# EAGLE design MiniLA (EAGLE 4.16)
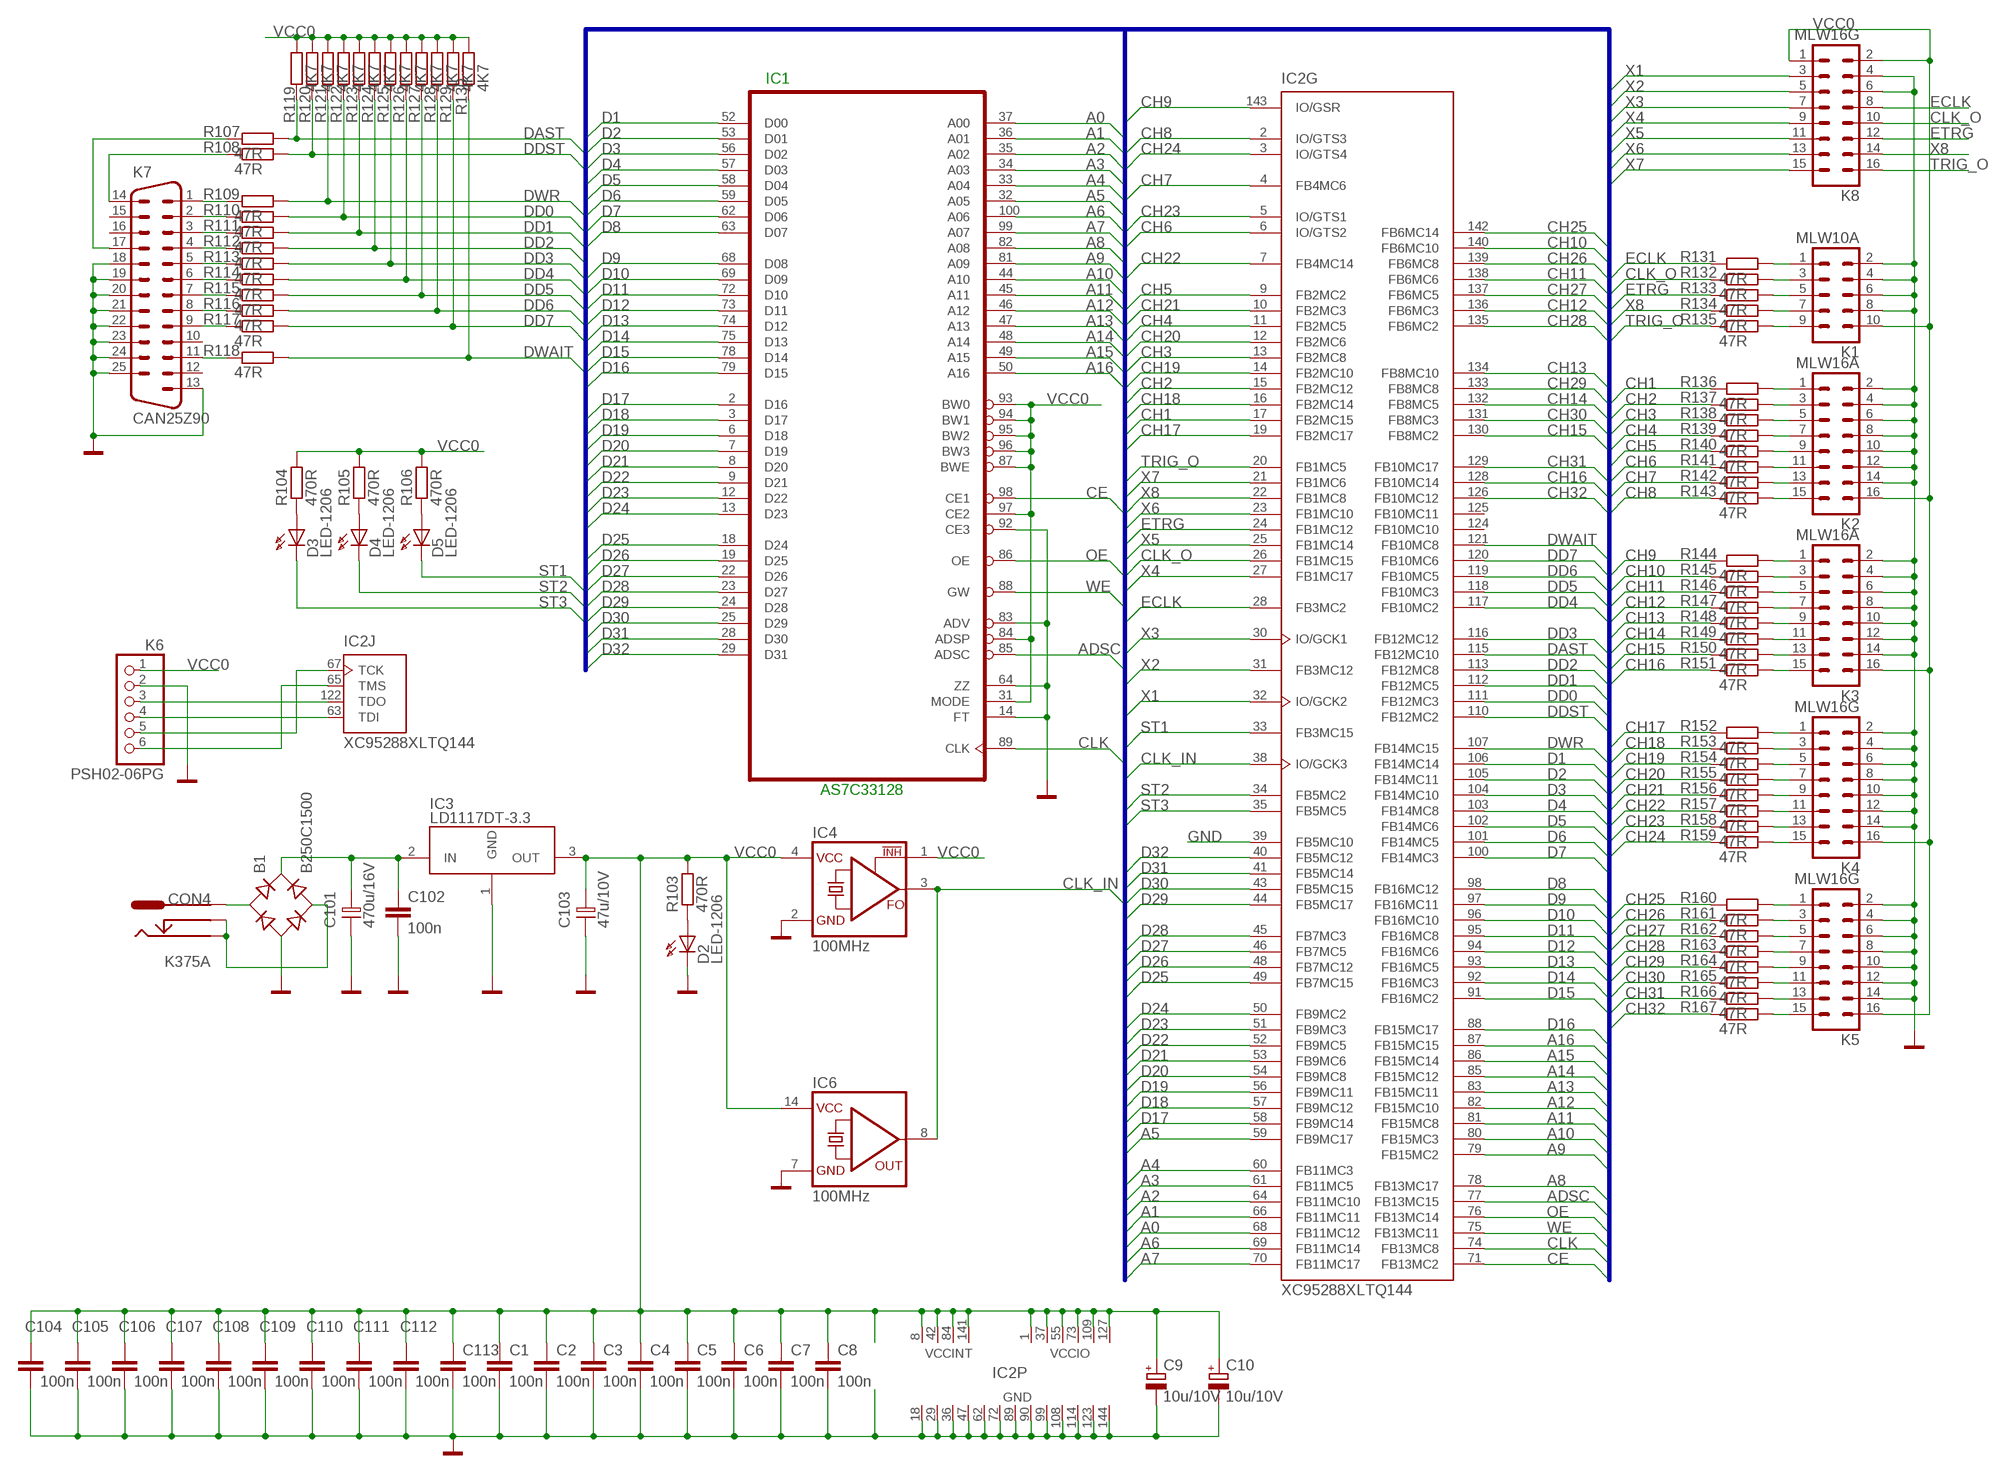
[diagram p0: schematic, sheet 1]

## Parts
B1  B250C1500  RB1A  [RB1A]
C1  100n  C-EUC1206  [C1206]
C2  100n  C-EUC1206  [C1206]
C3  100n  C-EUC1206  [C1206]
C4  100n  C-EUC1206  [C1206]
C5  100n  C-EUC1206  [C1206]
C6  100n  C-EUC1206  [C1206]
C7  100n  C-EUC1206  [C1206]
C8  100n  C-EUC1206  [C1206]
C9  10u/10V  CPOL-EUCT7343  [CT7343]
C10  10u/10V  CPOL-EUCT7343  [CT7343]
C101  470u/16V  ELC-5  [ES-5]
C102  100n  C-EUC1206  [C1206]
C103  47u/10V  ELC-2,5S  [ES-2,5S]
C104  100n  C-EUC1206  [C1206]
C105  100n  C-EUC1206  [C1206]
C106  100n  C-EUC1206  [C1206]
C107  100n  C-EUC1206  [C1206]
C108  100n  C-EUC1206  [C1206]
C109  100n  C-EUC1206  [C1206]
C110  100n  C-EUC1206  [C1206]
C111  100n  C-EUC1206  [C1206]
C112  100n  C-EUC1206  [C1206]
C113  100n  C-EUC1206  [C1206]
CON4  K375A  PWCON  [PWRC21]
D2  LED-1206  [SM-1206]
D3  LED-1206  [SM-1206]
D4  LED-1206  [SM-1206]
D5  LED-1206  [SM-1206]
IC1  AS7C33128  AS7C33128PQFP100  [QFP100]
IC2  XC95288XLTQ144  XC9500TQ144TQ144_45  [TQ144_45]
IC3  LD1117DT-3.3  LD1117DT  [TO-252]
IC4  100MHz  CO43TR  [CO43AND46]
IC6  100MHz  QG5860  [DIL14S]
K1  MLW10A  ML10L  [ML10L]
K2  MLW16A  ML16L  [ML16L]
K3  MLW16A  ML16L  [ML16L]
K4  MLW16G  ML16  [ML16]
K5  MLW16G  ML16  [ML16]
K6  PSH02-06PG  PINHD-1X6  [1X06]
K7  CAN25Z90  M25HP  [M25HP]
K8  MLW16G  ML16  [ML16]
R103  470R  R-EU_M0805  [M0805]
R104  470R  R-EU_M0805  [M0805]
R105  470R  R-EU_M0805  [M0805]
R106  470R  R-EU_M0805  [M0805]
R107  47R  R-EU_M0805  [M0805]
R108  47R  R-EU_M0805  [M0805]
R109  47R  R-EU_M0805  [M0805]
R110  47R  R-EU_M0805  [M0805]
R111  47R  R-EU_M0805  [M0805]
R112  47R  R-EU_M0805  [M0805]
R113  47R  R-EU_M0805  [M0805]
R114  47R  R-EU_M0805  [M0805]
R115  47R  R-EU_M0805  [M0805]
R116  47R  R-EU_M0805  [M0805]
R117  47R  R-EU_M0805  [M0805]
R118  47R  R-EU_M0805  [M0805]
R119  4K7  R-EU_M0805  [M0805]
R120  4K7  R-EU_M0805  [M0805]
R121  4K7  R-EU_M0805  [M0805]
R122  4K7  R-EU_M0805  [M0805]
R123  4K7  R-EU_M0805  [M0805]
R124  4K7  R-EU_M0805  [M0805]
R125  4K7  R-EU_M0805  [M0805]
R126  4K7  R-EU_M0805  [M0805]
R127  4K7  R-EU_M0805  [M0805]
R128  4K7  R-EU_M0805  [M0805]
R129  4K7  R-EU_M0805  [M0805]
R130  4K7  R-EU_M0805  [M0805]
R131  47R  R-EU_M0805  [M0805]
R132  47R  R-EU_M0805  [M0805]
R133  47R  R-EU_M0805  [M0805]
R134  47R  R-EU_M0805  [M0805]
R135  47R  R-EU_M0805  [M0805]
R136  47R  R-EU_M0805  [M0805]
R137  47R  R-EU_M0805  [M0805]
R138  47R  R-EU_M0805  [M0805]
R139  47R  R-EU_M0805  [M0805]
R140  47R  R-EU_M0805  [M0805]
R141  47R  R-EU_M0805  [M0805]
R142  47R  R-EU_M0805  [M0805]
R143  47R  R-EU_M0805  [M0805]
R144  47R  R-EU_M0805  [M0805]
R145  47R  R-EU_M0805  [M0805]
R146  47R  R-EU_M0805  [M0805]
R147  47R  R-EU_M0805  [M0805]
R148  47R  R-EU_M0805  [M0805]
R149  47R  R-EU_M0805  [M0805]
R150  47R  R-EU_M0805  [M0805]
R151  47R  R-EU_M0805  [M0805]
R152  47R  R-EU_M0805  [M0805]
R153  47R  R-EU_M0805  [M0805]
R154  47R  R-EU_M0805  [M0805]
R155  47R  R-EU_M0805  [M0805]
R156  47R  R-EU_M0805  [M0805]
R157  47R  R-EU_M0805  [M0805]
R158  47R  R-EU_M0805  [M0805]
R159  47R  R-EU_M0805  [M0805]
R160  47R  R-EU_M0805  [M0805]
R161  47R  R-EU_M0805  [M0805]
R162  47R  R-EU_M0805  [M0805]
R163  47R  R-EU_M0805  [M0805]
R164  47R  R-EU_M0805  [M0805]
R165  47R  R-EU_M0805  [M0805]
R166  47R  R-EU_M0805  [M0805]
R167  47R  R-EU_M0805  [M0805]

## Nets
A0: IC1.37(A00) IC2.68(G:FB11MC12)
A1: IC1.36(A01) IC2.66(G:FB11MC11)
A2: IC1.35(A02) IC2.64(G:FB11MC10)
A3: IC1.34(A03) IC2.61(G:FB11MC5)
A4: IC1.33(A04) IC2.60(G:FB11MC3)
A5: IC1.32(A05) IC2.59(G:FB9MC17)
A6: IC1.100(A06) IC2.69(G:FB11MC14)
A7: IC1.99(A07) IC2.70(G:FB11MC17)
A8: IC1.82(A08) IC2.78(G:FB13MC17)
A9: IC1.81(A09) IC2.79(G:FB15MC2)
A10: IC1.44(A10) IC2.80(G:FB15MC3)
A11: IC1.45(A11) IC2.81(G:FB15MC8)
A12: IC1.46(A12) IC2.82(G:FB15MC10)
A13: IC1.47(A13) IC2.83(G:FB15MC11)
A14: IC1.48(A14) IC2.85(G:FB15MC12)
A15: IC1.49(A15) IC2.86(G:FB15MC14)
A16: IC1.50(A16) IC2.87(G:FB15MC15)
ADSC: IC1.85(ADSC) IC2.77(G:FB13MC15)
CE: IC1.98(CE1) IC2.71(G:FB13MC2)
CH1: IC2.17(G:FB2MC15) R136.1
CH2: IC2.15(G:FB2MC12) R137.1
CH3: IC2.13(G:FB2MC8) R138.1
CH4: IC2.11(G:FB2MC5) R139.1
CH5: IC2.9(G:FB2MC2) R140.1
CH6: IC2.6(G:IO/GTS2) R141.1
CH7: IC2.4(G:FB4MC6) R142.1
CH8: IC2.2(G:IO/GTS3) R143.1
CH9: IC2.143(G:IO/GSR) R144.1
CH10: IC2.140(G:FB6MC10) R145.1
CH11: IC2.138(G:FB6MC6) R146.1
CH12: IC2.136(G:FB6MC3) R147.1
CH13: IC2.134(G:FB8MC10) R148.1
CH14: IC2.132(G:FB8MC5) R149.1
CH15: IC2.130(G:FB8MC2) R150.1
CH16: IC2.128(G:FB10MC14) R151.1
CH17: IC2.19(G:FB2MC17) R152.1
CH18: IC2.16(G:FB2MC14) R153.1
CH19: IC2.14(G:FB2MC10) R154.1
CH20: IC2.12(G:FB2MC6) R155.1
CH21: IC2.10(G:FB2MC3) R156.1
CH22: IC2.7(G:FB4MC14) R157.1
CH23: IC2.5(G:IO/GTS1) R158.1
CH24: IC2.3(G:IO/GTS4) R159.1
CH25: IC2.142(G:FB6MC14) R160.1
CH26: IC2.139(G:FB6MC8) R161.1
CH27: IC2.137(G:FB6MC5) R162.1
CH28: IC2.135(G:FB6MC2) R163.1
CH29: IC2.133(G:FB8MC8) R164.1
CH30: IC2.131(G:FB8MC3) R165.1
CH31: IC2.129(G:FB10MC17) R166.1
CH32: IC2.126(G:FB10MC12) R167.1
CLK: IC1.89(CLK) IC2.74(G:FB13MC8)
CLK_IN: IC2.38(G:IO/GCK3) IC4.3(OUTPUT) IC6.8(OUT)
CLK_O: IC2.26(G:FB1MC15) K8.10 R132.1
D1: IC1.52(D00) IC2.106(G:FB14MC14)
D2: IC1.53(D01) IC2.105(G:FB14MC11)
D3: IC1.56(D02) IC2.104(G:FB14MC10)
D4: IC1.57(D03) IC2.103(G:FB14MC8)
D5: IC1.58(D04) IC2.102(G:FB14MC6)
D6: IC1.59(D05) IC2.101(G:FB14MC5)
D7: IC1.62(D06) IC2.100(G:FB14MC3)
D8: IC1.63(D07) IC2.98(G:FB16MC12)
D9: IC1.68(D08) IC2.97(G:FB16MC11)
D10: IC1.69(D09) IC2.96(G:FB16MC10)
D11: IC1.72(D10) IC2.95(G:FB16MC8)
D12: IC1.73(D11) IC2.94(G:FB16MC6)
D13: IC1.74(D12) IC2.93(G:FB16MC5)
D14: IC1.75(D13) IC2.92(G:FB16MC3)
D15: IC1.78(D14) IC2.91(G:FB16MC2)
D16: IC1.79(D15) IC2.88(G:FB15MC17)
D17: IC1.2(D16) IC2.58(G:FB9MC14)
D18: IC1.3(D17) IC2.57(G:FB9MC12)
D19: IC1.6(D18) IC2.56(G:FB9MC11)
D20: IC1.7(D19) IC2.54(G:FB9MC8)
D21: IC1.8(D20) IC2.53(G:FB9MC6)
D22: IC1.9(D21) IC2.52(G:FB9MC5)
D23: IC1.12(D22) IC2.51(G:FB9MC3)
D24: IC1.13(D23) IC2.50(G:FB9MC2)
D25: IC1.18(D24) IC2.49(G:FB7MC15)
D26: IC1.19(D25) IC2.48(G:FB7MC12)
D27: IC1.22(D26) IC2.46(G:FB7MC5)
D28: IC1.23(D27) IC2.45(G:FB7MC3)
D29: IC1.24(D28) IC2.44(G:FB5MC17)
D30: IC1.25(D29) IC2.43(G:FB5MC15)
D31: IC1.28(D30) IC2.41(G:FB5MC14)
D32: IC1.29(D31) IC2.40(G:FB5MC12)
DAST: IC2.115(G:FB12MC10) R107.2 R119.1
DD0: IC2.111(G:FB12MC3) R110.2 R122.1
DD1: IC2.112(G:FB12MC5) R111.2 R123.1
DD2: IC2.113(G:FB12MC8) R112.2 R124.1
DD3: IC2.116(G:FB12MC12) R113.2 R125.1
DD4: IC2.117(G:FB10MC2) R114.2 R126.1
DD5: IC2.118(G:FB10MC3) R115.2 R127.1
DD6: IC2.119(G:FB10MC5) R116.2 R128.1
DD7: IC2.120(G:FB10MC6) R117.2 R129.1
DDST: IC2.110(G:FB12MC2) R108.2 R120.1
DWAIT: IC2.121(G:FB10MC8) R118.2 R130.1
DWR: IC2.107(G:FB14MC15) R109.2 R121.1
ECLK: IC2.28(G:FB3MC2) K8.8 R131.1
ETRG: IC2.24(G:FB1MC12) K8.12 R133.1
GND: B1.- C1.1 C2.1 C3.1 C4.1 C5.1 C6.1 C7.1 C8.1 C9.- C10.- C101.M C102.1 C103.M C104.1 C105.1 C106.1 C107.1 C108.1 C109.1 C110.1 C111.1 C112.1 C113.1 D2.2(C) IC1.14(FT) IC1.64(ZZ) IC1.83(ADV) IC1.92(CE3) IC2.18(P:GND) IC2.29(P:GND) IC2.36(P:GND) IC2.39(G:FB5MC10) IC2.47(P:GND) IC2.62(P:GND) IC2.72(P:GND) IC2.89(P:GND) IC2.90(P:GND) IC2.99(P:GND) IC2.108(P:GND) IC2.114(P:GND) IC2.123(P:GND) IC2.144(P:GND) IC3.1(GND) IC4.2(GND) IC6.7(GND) K1.2 K1.4 K1.6 K1.8 K2.2 K2.4 K2.6 K2.8 K2.10 K2.12 K2.14 K3.2 K3.4 K3.6 K3.8 K3.10 K3.12 K3.14 K4.2 K4.4 K4.6 K4.8 K4.10 K4.12 K4.14 K5.2 K5.4 K5.6 K5.8 K5.10 K5.12 K5.14 K6.2 K7.13 K7.18 K7.19 K7.20 K7.21 K7.22 K7.23 K7.24 K7.25 K8.4 K8.6
N$1: D2.1(A) R103.1
N$2: K7.9 R117.1
N$3: K7.8 R116.1
N$4: K7.7 R115.1
N$5: K7.6 R114.1
N$6: K7.5 R113.1
N$7: K7.4 R112.1
N$8: B1.AC1 CON4.1
N$9: K7.3 R111.1
N$10: K7.2 R110.1
N$11: B1.AC2 CON4.2 CON4.3
N$12: K7.1 R109.1
N$13: K1.1 R131.2
N$14: K1.3 R132.2
N$15: K1.5 R133.2
N$16: K1.7 R134.2
N$17: D3.1(A) R104.1
N$18: K1.9 R135.2
N$21: D4.1(A) R105.1
N$22: K7.11 R118.1
N$23: K7.14 R108.1
N$24: K2.1 R136.2
N$25: K2.3 R137.2
N$26: K2.5 R138.2
N$27: K2.7 R139.2
N$28: K2.9 R140.2
N$29: K2.11 R141.2
N$30: K2.13 R142.2
N$31: K2.15 R143.2
N$32: K3.1 R144.2
N$33: K3.3 R145.2
N$34: K3.5 R146.2
N$35: K3.7 R147.2
N$36: K3.9 R148.2
N$37: K3.11 R149.2
N$38: K3.13 R150.2
N$39: K3.15 R151.2
N$40: B1.+ C101.P C102.2 IC3.2(IN)
N$41: K4.1 R152.2
N$42: K4.3 R153.2
N$43: K4.5 R154.2
N$44: K4.7 R155.2
N$45: D5.1(A) R106.1
N$46: K4.9 R156.2
N$47: K4.11 R157.2
N$48: K4.13 R158.2
N$49: K4.15 R159.2
N$50: K5.1 R160.2
N$53: K5.3 R161.2
N$54: K5.5 R162.2
N$55: K5.7 R163.2
N$56: K5.9 R164.2
N$57: K5.11 R165.2
N$58: K5.13 R166.2
N$59: K5.15 R167.2
N$60: K7.17 R107.1
OE: IC1.86(OE) IC2.76(G:FB13MC14)
ST1: D5.2(C) IC2.33(G:FB3MC15)
ST2: D4.2(C) IC2.34(G:FB5MC2)
ST3: D3.2(C) IC2.35(G:FB5MC5)
TCK: IC2.67(J:TCK) K6.5
TDI: IC2.63(J:TDI) K6.4
TDO: IC2.122(J:TDO) K6.3
TMS: IC2.65(J:TMS) K6.6
TRIG_O: IC2.20(G:FB1MC5) K8.16 R135.1
VCC0: C1.2 C2.2 C3.2 C4.2 C5.2 C6.2 C7.2 C8.2 C9.+ C10.+ C103.P C104.2 C105.2 C106.2 C107.2 C108.2 C109.2 C110.2 C111.2 C112.2 C113.2 IC1.31(MODE) IC1.84(ADSP) IC1.87(BWE) IC1.93(BW0) IC1.94(BW1) IC1.95(BW2) IC1.96(BW3) IC1.97(CE2) IC2.1(P:VCCIO) IC2.8(P:VCCINT) IC2.37(P:VCCIO) IC2.42(P:VCCINT) IC2.55(P:VCCIO) IC2.73(P:VCCIO) IC2.84(P:VCCINT) IC2.109(P:VCCIO) IC2.127(P:VCCIO) IC2.141(P:VCCINT) IC3.3(OUT) IC4.1(INH) IC4.4(VCC) IC6.14(VCC) K1.10 K2.16 K3.16 K4.16 K5.16 K6.1 K8.1 K8.2 R103.2 R104.2 R105.2 R106.2 R119.2 R120.2 R121.2 R122.2 R123.2 R124.2 R125.2 R126.2 R127.2 R128.2 R129.2 R130.2
WE: IC1.88(GW) IC2.75(G:FB13MC11)
X1: IC2.32(G:IO/GCK2) K8.3
X2: IC2.31(G:FB3MC12) K8.5
X3: IC2.30(G:IO/GCK1) K8.7
X4: IC2.27(G:FB1MC17) K8.9
X5: IC2.25(G:FB1MC14) K8.11
X6: IC2.23(G:FB1MC10) K8.13
X7: IC2.21(G:FB1MC6) K8.15
X8: IC2.22(G:FB1MC8) K8.14 R134.1
Unconnected: IC2.124(G:FB10MC10) IC2.125(G:FB10MC11) K7.10 K7.12 K7.15 K7.16 K7.G1 K7.G2

## Buses
CH[1..36],D[1..31],A[0..16],X[1..7],CE,OE,WE,CLK,ADSC,ECLK,ETRG1,ETRG2,EX1,EX2,ICLK,ST1,ST2,ST3,DD[0..7],DWR,DDST,DAST,DWAIT

## Notes on the sheet
- IC1
- AS7C33128

## Power pins joined to a net without a drawn wire
GND: IC1.5(GND) IC1.10(GND) IC1.17(GND) IC1.21(GND) IC1.26(GND) IC1.39(GND) IC1.55(GND) IC1.60(GND) IC1.67(GND) IC1.71(GND) IC1.76(GND) IC1.90(GND)
VCC0: IC1.4(VCC0) IC1.11(VCC0) IC1.15(VCC0) IC1.20(VCC0) IC1.27(VCC0) IC1.41(VCC0) IC1.54(VCC0) IC1.61(VCC0) IC1.65(VCC0) IC1.70(VCC0) IC1.77(VCC0) IC1.91(VCC0)

## Library data of the parts
B1 = rectifier:RB1A: RECTIFIER 1 A
C1-C8 C102 C104-C113 = rcl:C-EU: CAPACITOR, European symbol
C9 C10 = rcl:CPOL-EU: POLARIZED CAPACITOR, European symbol
C101 = _yhf_spec:ELC-5
C103 = _yhf_spec:ELC-2,5S
CON4 = NETWORK:PWCON
D2-D5 = minila:LED-1206
IC1 = minila:AS7C33128
IC2 = minila:XC9500TQ144: Xilinx CPLD XC9500 TQFP144
IC3 = _pwrsupp:LD1117DT
IC4 = oscillator:CO43*
IC6 = crystal:QG5860: CRYSTAL RESONATOR
K1 = con-harting-ml:ML10L: HARTING
K2 K3 = con-harting-ml:ML16L: HARTING
K4 K5 K8 = con-harting-ml:ML16: HARTING
K6 = pinhead:PINHD-1X6: PIN HEADER
K7 = SUBD-A:M25HP
R103-R167 = rcl:R-EU_: RESISTOR, European symbol

## Board
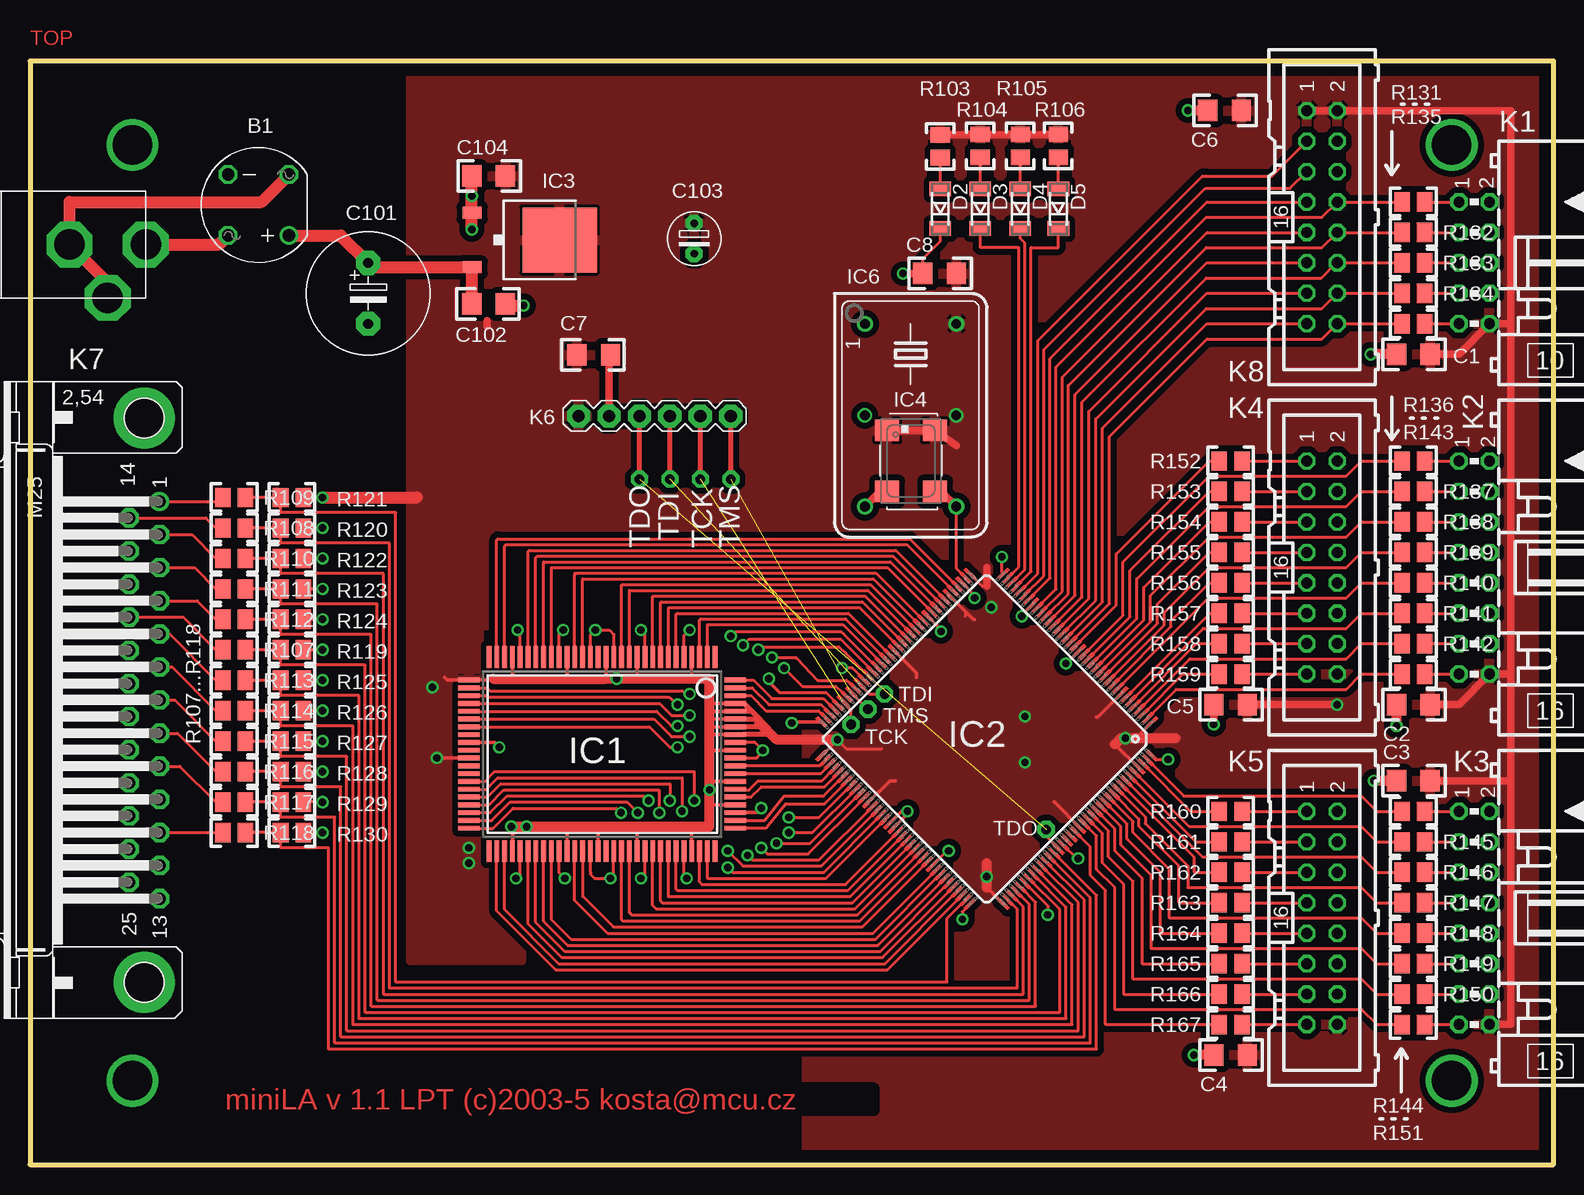
[diagram p1: board, top side]
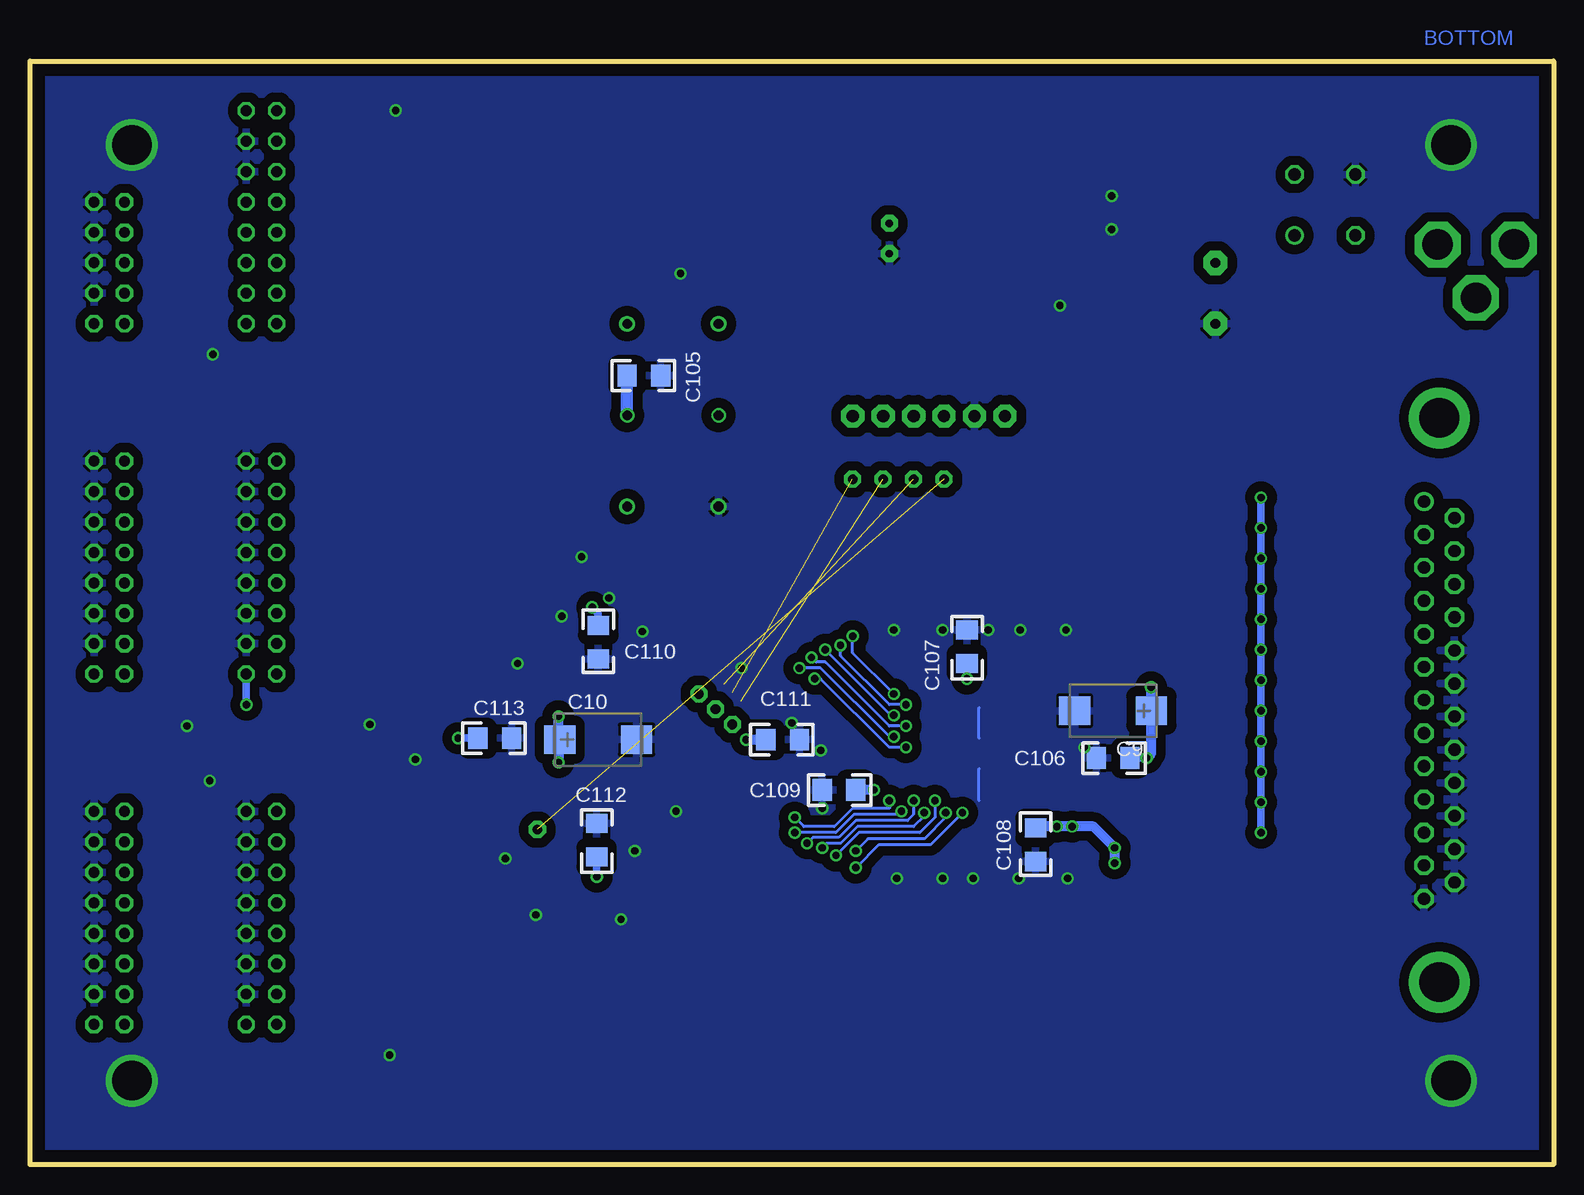
[diagram p2: board, bottom side, seen from below]

Size 127 x 92 mm. Coordinates in mm from the lower left corner, seen from the top.
Outline: 0,0 127,0 127,92 0,92 0,0
Copper layers (1*16): Top 0.035mm / dielectric 1.5mm / Bottom 0.035mm
Design rules "default": minimum track width 10mil, minimum drill 24mil, track to track 8mil, track to pad 8mil, pad to pad 8mil, via to via 8mil, smd to smd 8mil, copper to edge 40mil, drill to drill 8mil, minimum pad ring 10mil, minimum via ring 8mil, stop-mask expansion 0mil, vias tented up to drill 0mil, thermal gap 10mil

### Footprints (pad centres in the part's own frame; a part is rotated, then mirrored left to right if it is on the bottom)
RB1A = drill 1.016 round: + -2.54,2.54 | drill 1.016 octagon: - 2.54,-2.54; AC1 2.54,2.54; AC2 -2.54,-2.54
C1206 = smd 1.6 x 1.8: 1 -1.4,0; 2 1.4,0
CT7343 = smd 2.6 x 2.4: + -3.2,0; - 3.2,0
ES-5 = drill 0.813 pad 2.007 octagon: M 2.54,0; P -2.54,0
ES-2,5S = drill 0.61 pad 1.422 octagon: M 1.27,0; P -1.27,0
PWRC21 = drill 2.54 pad 3.81 octagon: 1 0,4.445; 2 6.35,4.445; 3 3.175,8.89
SM-1206 = smd 1.2 x 1.8: 1 -1.65,0; 2 1.65,0
QFP100 = smd 0.4 x 1.8: 1 -10.695,-6.83; 2 -10.045,-6.83; 3 -9.395,-6.83; 4 -8.745,-6.83; 5 -8.095,-6.83; 6 -7.445,-6.83; 7 -6.795,-6.83; 8 -6.145,-6.83; 9 -5.495,-6.83; 10 -4.845,-6.83; 11 -4.195,-6.83; 12 -3.545,-6.83; 13 -2.895,-6.83; 14 -2.245,-6.83; 15 -1.595,-6.83; 16 -0.945,-6.83; 17 -0.295,-6.83; 18 0.355,-6.83; 19 1.005,-6.83; 20 1.655,-6.83; 21 2.305,-6.83; 22 2.955,-6.83; 23 3.605,-6.83; 24 4.255,-6.83; 25 4.905,-6.83; 26 5.555,-6.83; 27 6.205,-6.83; 28 6.855,-6.83; 29 7.505,-6.83; 30 8.155,-6.83; 51 8.155,9.37; 52 7.505,9.37; 53 6.855,9.37; 54 6.205,9.37; 55 5.555,9.37; 56 4.905,9.37; 57 4.255,9.37; 58 3.605,9.37; 59 2.955,9.37; 60 2.305,9.37; 61 1.655,9.37; 62 1.005,9.37; 63 0.355,9.37; 64 -0.295,9.37; 65 -0.945,9.37; 66 -1.595,9.37; 67 -2.245,9.37; 68 -2.895,9.37; 69 -3.545,9.37; 70 -4.195,9.37; 71 -4.845,9.37; 72 -5.495,9.37; 73 -6.145,9.37; 74 -6.795,9.37; 75 -7.445,9.37; 76 -8.095,9.37; 77 -8.745,9.37; 78 -9.395,9.37; 79 -10.045,9.37; 80 -10.695,9.37 | smd 1.8 x 0.4: 31 9.83,-4.905; 32 9.83,-4.255; 33 9.83,-3.605; 34 9.83,-2.955; 35 9.83,-2.305; 36 9.83,-1.655; 37 9.83,-1.005; 38 9.83,-0.355; 39 9.83,0.295; 40 9.83,0.945; 41 9.83,1.595; 42 9.83,2.245; 43 9.83,2.895; 44 9.83,3.545; 45 9.83,4.195; 46 9.83,4.845; 47 9.83,5.495; 48 9.83,6.145; 49 9.83,6.795; 50 9.83,7.445; 81 -12.37,7.445; 82 -12.37,6.795; 83 -12.37,6.145; 84 -12.37,5.495; 85 -12.37,4.845; 86 -12.37,4.195; 87 -12.37,3.545; 88 -12.37,2.895; 89 -12.37,2.245; 90 -12.37,1.595; 91 -12.37,0.945; 92 -12.37,0.295; 93 -12.37,-0.355; 94 -12.37,-1.005; 95 -12.37,-1.655; 96 -12.37,-2.305; 97 -12.37,-2.955; 98 -12.37,-3.605; 99 -12.37,-4.255; 100 -12.37,-4.905
TQ144_45 = smd 0.203 x 0.203: 1 13.789,2.684; 2 13.435,3.038; 3 13.082,3.391; 4 12.728,3.745; 5 12.374,4.098; 6 12.021,4.452; 7 11.667,4.805; 8 11.314,5.159; 9 10.96,5.513; 10 10.607,5.866; 11 10.253,6.22; 12 9.899,6.574; 13 9.546,6.927; 14 9.192,7.28; 15 8.839,7.634; 16 8.485,7.987; 17 8.132,8.341; 18 7.778,8.695; 19 7.425,9.048; 20 7.071,9.402; 21 6.718,9.755; 22 6.364,10.109; 23 6.01,10.462; 24 5.657,10.816; 25 5.303,11.169; 26 4.95,11.523; 27 4.596,11.877; 28 4.243,12.23; 29 3.889,12.584; 30 3.535,12.937; 31 3.182,13.291; 32 2.828,13.644; 33 2.475,13.998; 34 2.121,14.351; 35 1.768,14.705; 36 1.414,15.059; 37 -1.414,15.059; 38 -1.768,14.705; 39 -2.121,14.351; 40 -2.475,13.998; 41 -2.828,13.644; 42 -3.182,13.291; 43 -3.535,12.937; 44 -3.889,12.584; 45 -4.243,12.23; 46 -4.596,11.877; 47 -4.95,11.523; 48 -5.303,11.169; 49 -5.657,10.816; 50 -6.01,10.462; 51 -6.364,10.109; 52 -6.718,9.755; 53 -7.071,9.402; 54 -7.425,9.048; 55 -7.778,8.695; 56 -8.132,8.341; 57 -8.485,7.987; 58 -8.839,7.634; 59 -9.192,7.28; 60 -9.546,6.927; 61 -9.899,6.574; 62 -10.253,6.22; 63 -10.607,5.866; 64 -10.96,5.513; 65 -11.314,5.159; 66 -11.667,4.805; 67 -12.021,4.452; 68 -12.374,4.098; 69 -12.728,3.745; 70 -13.082,3.391; 71 -13.435,3.038; 72 -13.789,2.684; 73 -13.789,-0.144; 74 -13.435,-0.498; 75 -13.082,-0.851; 76 -12.728,-1.205; 77 -12.374,-1.558; 78 -12.021,-1.912; 79 -11.667,-2.265; 80 -11.314,-2.619; 81 -10.96,-2.973; 82 -10.607,-3.326; 83 -10.253,-3.68; 84 -9.899,-4.034; 85 -9.546,-4.387; 86 -9.192,-4.74; 87 -8.839,-5.094; 88 -8.485,-5.447; 89 -8.132,-5.801; 90 -7.778,-6.155; 91 -7.425,-6.508; 92 -7.071,-6.862; 93 -6.718,-7.215; 94 -6.364,-7.569; 95 -6.01,-7.922; 96 -5.657,-8.276; 97 -5.303,-8.629; 98 -4.95,-8.983; 99 -4.596,-9.336; 100 -4.243,-9.69; 101 -3.889,-10.044; 102 -3.535,-10.397; 103 -3.182,-10.751; 104 -2.828,-11.104; 105 -2.475,-11.458; 106 -2.121,-11.812; 107 -1.768,-12.165; 108 -1.414,-12.519; 109 1.414,-12.519; 110 1.768,-12.165; 111 2.121,-11.812; 112 2.475,-11.458; 113 2.828,-11.104; 114 3.182,-10.751; 115 3.535,-10.397; 116 3.889,-10.044; 117 4.243,-9.69; 118 4.596,-9.336; 119 4.95,-8.983; 120 5.303,-8.629; 121 5.657,-8.276; 122 6.01,-7.922; 123 6.364,-7.569; 124 6.718,-7.215; 125 7.071,-6.862; 126 7.425,-6.508; 127 7.778,-6.155; 128 8.132,-5.801; 129 8.485,-5.447; 130 8.839,-5.094; 131 9.192,-4.74; 132 9.546,-4.387; 133 9.899,-4.034; 134 10.253,-3.68; 135 10.607,-3.326; 136 10.96,-2.973; 137 11.314,-2.619; 138 11.667,-2.265; 139 12.021,-1.912; 140 12.374,-1.558; 141 12.728,-1.205; 142 13.082,-0.851; 143 13.435,-0.498; 144 13.789,-0.144
TO-252 = smd 1 x 1.6: 1 -2.28,-6.07; 2 2.28,-6.07 | smd 5.4 x 6.2: 3 0,1.23
CO43AND46 = smd 1.8 x 2: 1 0,0; 2 5.08,0; 3 5.08,4; 4 0,4
DIL14S = drill 0.813 round: 1 -7.62,-3.81; 7 7.62,-3.81; 8 7.62,3.81; 14 -7.62,3.81
ML10L = drill 0.914 octagon: 1 -5.08,-1.27; 2 -5.08,1.27; 3 -2.54,-1.27; 4 -2.54,1.27; 5 0,-1.27; 6 0,1.27; 7 2.54,-1.27; 8 2.54,1.27; 9 5.08,-1.27; 10 5.08,1.27
ML16L = drill 0.914 octagon: 1 -8.89,-1.27; 2 -8.89,1.27; 3 -6.35,-1.27; 4 -6.35,1.27; 5 -3.81,-1.27; 6 -3.81,1.27; 7 -1.27,-1.27; 8 -1.27,1.27; 9 1.27,-1.27; 10 1.27,1.27; 11 3.81,-1.27; 12 3.81,1.27; 13 6.35,-1.27; 14 6.35,1.27; 15 8.89,-1.27; 16 8.89,1.27
ML16 = drill 0.914 octagon: 1 -8.89,-1.27; 2 -8.89,1.27; 3 -6.35,-1.27; 4 -6.35,1.27; 5 -3.81,-1.27; 6 -3.81,1.27; 7 -1.27,-1.27; 8 -1.27,1.27; 9 1.27,-1.27; 10 1.27,1.27; 11 3.81,-1.27; 12 3.81,1.27; 13 6.35,-1.27; 14 6.35,1.27; 15 8.89,-1.27; 16 8.89,1.27
1X06 = drill 1.016 pad 1.93 octagon: 1 -6.35,0; 2 -3.81,0; 3 -1.27,0; 4 1.27,0; 5 3.81,0; 6 6.35,0
M25HP = drill 1.016 pad 1.6 round: 1 -16.561,1.27 | drill 1.016 pad 1.6 octagon: 2 -13.792,1.27; 3 -11.049,1.27; 4 -8.28,1.27; 5 -5.512,1.27; 6 -2.769,1.27; 7 0,1.27; 8 2.769,1.27; 9 5.512,1.27; 10 8.28,1.27; 11 11.049,1.27; 12 13.792,1.27; 13 16.561,1.27; 14 -15.189,-1.27; 15 -12.421,-1.27; 16 -9.652,-1.27; 17 -6.909,-1.27; 18 -4.14,-1.27; 19 -1.372,-1.27; 20 1.372,-1.27; 21 4.14,-1.27; 22 6.909,-1.27; 23 9.652,-1.27; 24 12.421,-1.27; 25 15.189,-1.27 | drill 3.302 pad 5.08 round: G1 -23.52,0; G2 23.52,0
M0805 = smd 1.3 x 1.6: 1 -0.95,0; 2 0.95,0

### Placement (x,y rotation side)
B1  19.05,80.01 180 top
C1  115.32,67.56 0 top
C2  115.32,38.35 0 top
C3  115.32,32 0 top
C4  100.08,9.14 0 top
C5  100.08,38.35 0 top
C6  99.57,87.88 0 top
C7  46.99,67.5 180 top
C8  75.82,74.3 0 top
C9  36.72,37.85 180 bottom
C10  79.64,35.44 0 bottom
C101  28.19,72.64 270 top
C102  38.23,71.75 180 top
C103  55.37,77.22 270 top
C104  38.23,82.42 0 top
C105  75.82,65.79 180 bottom
C106  36.7,33.91 0 bottom
C107  48.9,43.18 270 bottom
C108  43.18,26.67 90 bottom
C109  59.56,31.24 0 bottom
C110  79.63,43.56 90 bottom
C111  64.26,35.43 180 bottom
C112  79.76,27.05 270 bottom
C113  88.27,35.56 180 bottom
CON4  9.65,81.15 180 top
D2  75.88,79.69 270 top
D3  79.22,79.69 270 top
D4  82.55,79.69 270 top
D5  85.72,79.69 270 top
IC1  46.42,35.5 180 top
IC2  79.76,34.23 0 top
IC3  42.93,77.09 270 top
IC4  71.44,61.21 270 top
IC6  73.41,62.48 270 top
K1  120.4,75.18 270 top
K2  120.4,49.78 270 top
K3  120.4,20.57 270 top
K4  107.7,49.78 270 top
K5  107.7,20.57 270 top
K6  52.07,62.42 0 top
K7  9.53,38.73 270 top
K8  107.7,78.99 270 top
R103  75.88,84.9 90 top
R104  79.22,84.93 90 top
R105  82.55,84.93 90 top
R106  85.72,84.93 90 top
R107  17.02,42.93 0 top
R108  17.02,53.09 0 top
R109  17.02,55.63 0 top
R110  17.02,50.55 0 top
R111  17.02,48.01 0 top
R112  17.02,45.47 0 top
R113  17.02,40.39 0 top
R114  17.02,37.85 0 top
R115  17.02,35.31 0 top
R116  17.02,32.77 0 top
R117  17.02,30.23 0 top
R118  17.02,27.69 0 top
R119  21.84,42.93 0 top
R120  21.84,53.09 0 top
R121  21.84,55.63 0 top
R122  21.84,50.55 0 top
R123  21.84,48.01 0 top
R124  21.84,45.47 0 top
R125  21.84,40.39 0 top
R126  21.84,37.85 0 top
R127  21.84,35.31 0 top
R128  21.84,32.77 0 top
R129  21.84,30.23 0 top
R130  21.84,27.69 0 top
R131  115.32,80.26 0 top
R132  115.32,77.72 0 top
R133  115.32,75.18 0 top
R134  115.32,72.64 0 top
R135  115.32,70.1 0 top
R136  115.32,58.67 0 top
R137  115.32,56.13 0 top
R138  115.32,53.59 0 top
R139  115.32,51.05 0 top
R140  115.32,48.51 0 top
R141  115.32,45.97 0 top
R142  115.32,43.43 0 top
R143  115.32,40.89 0 top
R144  115.32,29.46 0 top
R145  115.32,26.92 0 top
R146  115.32,24.38 0 top
R147  115.32,21.84 0 top
R148  115.32,19.3 0 top
R149  115.32,16.76 0 top
R150  115.32,14.22 0 top
R151  115.32,11.68 0 top
R152  100.08,58.67 0 top
R153  100.08,56.13 0 top
R154  100.08,53.59 0 top
R155  100.08,51.05 0 top
R156  100.08,48.51 0 top
R157  100.08,45.97 0 top
R158  100.08,43.43 0 top
R159  100.08,40.89 0 top
R160  100.08,29.46 0 top
R161  100.08,26.92 0 top
R162  100.08,24.38 0 top
R163  100.08,21.84 0 top
R164  100.08,19.3 0 top
R165  100.08,16.76 0 top
R166  100.08,14.22 0 top
R167  100.08,11.68 0 top

### Tracks (layer width: path | path; a pad name or v marks a point on that pad's centre or on a via)
A0  (via drill 0.61)
  Top 0.254: IC1.37 51.64,36.5 53.34,34.8 v53.98,34.8 | 62.48,39.37 66.34,39.37 IC2.68
  Top 0.305: 62.48,39.37 61.59,40.26 v61.59,40.51
  Bottom 0.254: v53.98,34.8 55.37,34.8 61.09,40.51 v61.59,40.51
A1  (via drill 0.61)
  Top 0.254: IC1.36 52,37.15 53.47,35.69 v54.99,35.69 | IC2.66 67.18,39.88 64.39,39.88 v62.87,41.4
  Bottom 0.254: v54.99,35.69 55.37,35.69 61.09,41.4 v62.87,41.4
A2  (via drill 0.61)
  Top 0.254: IC1.35 52.24,37.8 53.47,36.58 v53.98,36.58 | IC2.64 68.07,40.39 65.66,40.39 63.88,42.24 63.83,42.29 v61.85,42.29
  Bottom 0.254: v53.98,36.58 55.37,36.58 60.71,41.91 61.47,41.91 v61.85,42.29
A3  (via drill 0.61)
  Top 0.254: IC1.34 52.48,38.45 53.47,37.47 v54.99,37.47 | IC2.61 67.98,42.67 67.44,43.18 61.09,43.18 v60.71,42.93
  Bottom 0.254: v54.99,37.47 55.24,37.47 v60.71,42.93
A4  (via drill 0.61)
  Top 0.254: 70.23,41.05 70.21,41.07 IC2.60 67.56,43.81 59.94,43.81 v59.44,43.31 | IC1.33 37.99,39.1 38.1,38.99 53.23,38.97 v53.98,38.35
  Bottom 0.254: v53.98,38.35 55.37,38.35 59.44,42.42 v59.44,43.31
A5  (via drill 0.61)
  Top 0.254: IC2.59 67.88,44.2 67.56,44.45 58.8,44.45 v58.42,44.07 | IC1.32 38.1,39.75 38.35,39.5 54.35,39.5 v54.99,39.24
  Bottom 0.254: v54.99,39.24 58.42,42.67 v58.42,44.07
A6
  Top 0.254: IC1.100 60.31,40.4 61.85,38.86 66.14,38.86 IC2.69
A7
  Top 0.254: IC1.99 60.2,39.75 61.59,38.35 65.94,38.35 IC2.70
A8
  Top 0.254: IC2.78 66.16,30.73 62.87,30.73 61.21,28.7 IC1.82
A9
  Top 0.254: IC2.79 66.23,30.1 62.99,30.1 61.34,28.07 58.8,28.07 58.8,28.06 IC1.81
A10  (via drill 0.61)
  Top 0.254: IC1.44 37.92,31.95 38.73,32.77 55.37,32.77 v55.37,30.35 | IC2.80 65.79,28.96 v63.25,28.96
  Bottom 0.254: v63.25,28.96 62.48,28.19 59.94,28.19 58.42,29.72 55.37,29.72 v55.37,30.35
A11  (via drill 0.61)
  Top 0.254: 68.8,31.21 68.8,31.22 IC2.81 65.23,27.69 v63.25,27.69 | IC1.45 38.03,31.3 38.99,32.26 54.36,32.26 v54.36,29.46
  Bottom 0.254: v63.25,27.69 59.82,27.69 58.29,29.21 54.61,29.21 v54.36,29.46
A12  (via drill 0.61)
  Top 0.254: IC2.82 69.15,30.92 65.02,26.8 v62.23,26.8 | IC1.46 38.15,30.65 39.24,31.75 53.34,31.75 v53.34,30.35
  Bottom 0.254: v62.23,26.8 61.72,27.3 59.56,27.3 58.17,28.7 53.85,28.7 53.34,29.21 v53.34,30.35
A13  (via drill 0.61)
  Top 0.254: v60.96,26.42 61.47,25.91 64.86,25.91 IC2.83 | IC1.47 38.26,30 39.5,31.24 52.45,31.24 v52.45,29.34
  Bottom 0.254: v60.96,26.42 60.58,26.8 59.44,26.8 58.04,28.19 53.34,28.19 52.45,29.08 v52.45,29.34
A14  (via drill 0.61)
  Top 0.254: IC2.85 65.77,25.4 60.2,25.4 v59.82,25.78 | IC1.48 38.37,29.35 39.75,30.73 51.18,30.73 v51.56,30.35
  Bottom 0.254: v59.82,25.78 57.91,27.69 52.83,27.69 51.56,28.96 v51.56,30.35
A15  (via drill 0.61)
  Top 0.254: IC1.49 38.48,28.7 40.01,30.23 49.78,30.23 v50.67,29.34 | IC2.86 65.97,24.89 59.44,24.89 v58.17,26.16
  Bottom 0.254: v58.17,26.16 57.15,27.18 52.45,27.18 50.67,28.96 v50.67,29.34
A16  (via drill 0.61)
  Top 0.254: IC1.50 38.59,28.05 40.26,29.72 48.9,29.72 v49.28,29.34 | IC2.87 66.17,24.38 58.55,24.38 v58.17,24.77
  Bottom 0.254: v58.17,24.77 56.26,26.67 51.94,26.67 v49.28,29.34
ADSC
  Top 0.254: IC2.77 66.21,31.5 60.96,31.5 60.12,30.65 IC1.85
CE
  Top 0.254: IC1.98 60.09,39.1 61.34,37.85 65.74,37.85 IC2.71
CH1
  Top 0.254: R136.1 111,58.67 109.73,57.4 98.3,57.4 91.12,50.23 91.12,45.8 IC2.17
CH2
  Top 0.254: R137.1 111,56.13 109.73,54.86 98.3,54.86 92.27,48.83 92.27,45.53 IC2.15
CH3
  Top 0.254: R138.1 111,53.59 109.73,52.32 98.3,52.32 93.41,47.43 93.41,45.26 IC2.13
CH4
  Top 0.254: R139.1 111,51.05 109.73,49.78 98.3,49.78 94.55,46.04 94.55,44.99 IC2.11
CH5
  Top 0.254: IC2.9 98.22,47.24 109.73,47.24 111,48.51 R140.1
CH6
  Top 0.254: IC2.6 97.8,44.7 109.73,44.7 111,45.97 R141.1
CH7
  Top 0.254: IC2.4 96.68,42.16 109.73,42.16 111,43.43 R142.1
CH8
  Top 0.254: IC2.2 95.55,39.62 109.73,39.62 111,40.89 R143.1
CH9
  Top 0.254: IC2.143 96.19,30.73 111,30.73 112.27,29.46 R144.1
CH10
  Top 0.254: IC2.140 96.61,28.19 111,28.19 112.27,26.92 R145.1
CH11
  Top 0.254: IC2.138 97.73,25.65 111,25.65 112.27,24.38 R146.1
CH12
  Top 0.254: IC2.136 92.96,29.01 92.96,28.45 96.52,24.89 96.52,23.11 111,23.11 112.27,21.84 R147.1
CH13
  Top 0.254: IC2.134 91.95,28.61 91.95,27.69 95,24.64 95,20.57 111,20.57 112.27,19.3 R148.1
CH14
  Top 0.254: IC2.132 90.93,28.21 90.93,26.67 93.47,24.13 93.47,18.03 111,18.03 112.27,16.76 R149.1
CH15
  Top 0.254: IC2.130 89.92,27.81 89.92,25.65 91.95,23.62 91.95,15.49 111,15.49 112.27,14.22 R150.1
CH16
  Top 0.254: IC2.128 88.9,27.41 88.9,24.64 90.42,23.11 90.42,12.95 111,12.95 112.27,11.68 R151.1
CH17
  Top 0.254: R152.1 98.3,58.67 90.55,50.93 90.55,46.65 IC2.19
CH18
  Top 0.254: R153.1 98.3,56.13 91.69,49.53 91.69,45.67 IC2.16
CH19
  Top 0.254: R154.1 98.3,53.59 92.84,48.13 92.84,45.4 IC2.14
CH20
  Top 0.254: R155.1 98.3,51.05 93.98,46.74 93.98,45.12 IC2.12
CH21
  Top 0.254: R156.1 98.3,48.51 95.12,45.34 95.12,44.85 IC2.10
CH22
  Top 0.254: IC2.7 98.36,45.97 R157.1
CH23
  Top 0.254: IC2.5 97.24,43.43 R158.1
CH24
  Top 0.254: IC2.3 96.11,40.89 R159.1
CH25
  Top 0.254: IC2.142 96.75,29.46 R160.1
CH26
  Top 0.254: IC2.139 97.17,26.92 R161.1
CH27
  Top 0.254: IC2.137 97.03,25.65 97.03,24.38 R162.1
CH28
  Top 0.254: IC2.135 92.46,28.81 92.46,28.19 95.76,24.89 95.76,21.84 R163.1
CH29
  Top 0.254: IC2.133 91.44,28.41 91.44,27.18 94.23,24.38 94.23,19.3 R164.1
CH30
  Top 0.254: IC2.131 90.42,28.01 90.42,26.16 92.71,23.88 92.71,16.76 R165.1
CH31
  Top 0.254: IC2.129 89.41,27.61 89.41,25.15 91.19,23.37 91.19,14.22 R166.1
CH32
  Top 0.254: IC2.126 88.39,26.51 88.39,24.13 89.66,22.86 89.66,11.68 R167.1
CLK
  Top 0.254: IC1.89 58.8,33.26 58.8,33.27 65.87,33.27 IC2.74
CLK_IN
  Top 0.254: IC2.38 77.22,49.7 IC6.8
  Top 0.61: IC4.3 75.95,56.13 IC6.8
CLK_O
  Top 0.254: R132.1 K8.10 107.7,76.45 98.04,76.45 86.55,64.96 86.55,47.59 IC2.26
D1
  Top 0.254: IC2.106 71.48,16.26 43.81,16.26 38.91,21.16 IC1.52
D2
  Top 0.254: IC2.105 71.28,16.76 44.07,16.76 39.56,21.27 IC1.53
D3
  Top 0.254: IC2.104 71.08,17.27 44.32,17.27 41.51,20.08 IC1.56
D4
  Top 0.254: IC2.103 70.88,17.78 44.58,17.78 42.16,20.19 IC1.57
D5
  Top 0.254: IC2.102 70.68,18.29 44.83,18.29 42.81,20.3 IC1.58
D6
  Top 0.254: IC2.101 70.48,18.8 45.09,18.8 43.46,20.42 IC1.59
D7
  Top 0.254: IC2.100 70.28,19.3 48.13,19.3 45.41,22.02 IC1.62
D8
  Top 0.254: IC2.98 69.38,19.81 48.64,19.81 46.1,22.35 46.1,26.16 IC1.63
D9
  Top 0.254: IC2.97 69.17,20.32 49.4,20.32 49.31,20.41 IC1.68
D10
  Top 0.254: IC2.96 68.98,20.83 50.16,20.83 49.96,21.03 IC1.69
D11
  Top 0.254: IC2.95 68.78,21.34 52.2,21.34 51.91,21.62 IC1.72
D12
  Top 0.254: IC2.94 68.58,21.84 52.7,21.84 52.56,21.98 IC1.73
D13
  Top 0.254: IC2.93 68.38,22.35 53.21,22.35 53.21,26.16 IC1.74
D14
  Top 0.254: IC2.92 68.18,22.86 53.98,22.86 53.86,22.97 IC1.75
D15
  Top 0.254: IC2.91 67.98,23.37 56.01,23.37 55.81,23.56 IC1.78
D16
  Top 0.254: IC2.88 66.37,23.88 56.46,23.88 IC1.79
D17
  Top 0.254: IC2.58 67.76,45.02 56.48,45.02 56.46,45 IC1.2
D18
  Top 0.254: IC2.57 67.99,45.5 55.91,45.5 55.81,45.4 IC1.3
D19
  Top 0.254: IC2.56 68.22,45.97 53.94,45.97 53.86,45.89 IC1.6
D20
  Top 0.254: IC2.54 69.16,46.45 53.28,46.45 53.21,46.39 IC1.7
D21
  Top 0.254: IC2.53 69.39,46.93 52.61,46.93 52.56,46.88 IC1.8
D22
  Top 0.254: IC2.52 69.62,47.4 51.94,47.4 51.91,47.37 IC1.9
D23
  Top 0.254: IC2.51 69.85,47.88 49.97,47.88 49.96,47.87 IC1.12
D24
  Top 0.254: IC2.50 70.08,48.35 49.44,48.35 49.31,48.36 IC1.13
D25
  Top 0.254: IC2.49 70.31,48.83 46.1,48.83 46.06,48.79 IC1.18
D26
  Top 0.254: IC2.48 70.54,49.31 45.43,49.31 45.41,49.16 IC1.19
D27
  Top 0.254: IC2.46 71.48,49.78 43.5,49.78 43.46,49.75 IC1.22
D28
  Top 0.254: IC2.45 71.71,50.26 42.83,50.26 42.81,50.12 IC1.23
D29
  Top 0.254: IC2.44 71.94,50.74 42.29,50.74 42.16,50.61 IC1.24
D30
  Top 0.254: IC2.43 72.17,51.21 41.62,51.21 41.51,51.1 IC1.25
D31
  Top 0.254: IC2.41 73.11,51.69 39.66,51.69 39.56,51.6 IC1.28
D32
  Top 0.254: IC2.40 73.34,52.16 38.99,52.16 38.91,52.09 IC1.29
DAST
  Top 0.254: IC2.115 85.85,21.27 85.85,12.7 27.94,12.7 27.94,41.66 20.89,41.66 R119.1 R107.2
DD0
  Top 0.254: IC2.111 82.8,21.49 82.8,14.22 29.46,14.22 29.46,49.28 20.89,49.28 R122.1 R110.2
DD1
  Top 0.254: IC2.112 83.31,21.69 83.31,13.72 28.96,13.72 28.96,46.74 20.89,46.74 R123.1 R111.2
DD2
  Top 0.254: IC2.113 83.82,21.89 83.82,13.21 28.45,13.21 28.45,44.2 20.89,44.2 R124.1 R112.2
DD3
  Top 0.254: IC2.116 86.36,21.47 86.36,12.19 27.43,12.19 27.43,39.12 20.89,39.12 R125.1 R113.2
DD4
  Top 0.254: IC2.117 86.87,21.67 86.87,11.68 26.92,11.68 26.92,36.58 20.89,36.58 R126.1 R114.2
DD5
  Top 0.254: IC2.118 87.38,21.87 87.38,11.18 26.42,11.18 26.42,34.04 20.89,34.04 R127.1 R115.2
DD6
  Top 0.254: IC2.119 87.88,22.07 87.88,10.67 25.91,10.67 25.91,31.5 20.89,31.5 R128.1 R116.2
DD7
  Top 0.254: IC2.120 88.39,22.27 88.39,10.16 25.4,10.16 25.4,28.96 20.89,28.96 R129.1 R117.2
DDST
  Top 0.254: IC2.110 82.3,21.29 82.3,14.73 29.97,14.73 29.97,51.82 20.89,51.82 R120.1 R108.2
DWAIT
  Top 0.254: IC2.121 88.9,22.46 88.9,9.65 24.89,9.65 24.89,26.42 20.89,26.42 R130.1 R118.2
DWR
  Top 0.254: R109.2 R121.1 20.89,54.36 30.48,54.36 30.48,15.24 76.45,15.24 76.45,20.53 IC2.107
ECLK
  Top 0.254: R131.1 K8.8 107.7,78.99 98.04,78.99 85.53,66.48 85.53,47.99 IC2.28
ETRG
  Top 0.254: R133.1 K8.12 108.9,75.18 107.63,73.91 98.04,73.91 87.69,63.56 87.69,47.32 IC2.24
GND  (via drill 0.61, 3.3)
  Top 0.254: 44.07,42.42 44.11,42.37 IC1.21 44.11,44.24 v44.45,44.58 | IC2.108 77.72,21.09 v77.72,20.45 | IC1.55 40.86,24.23 v40.51,23.88 | IC1.60 44.11,24.34 v44.58,23.88 | IC1.71 51.26,24.21 v50.93,23.88 | IC1.67 48.66,24.15 v48.39,23.88 47.05,23.88 46.71,24.21 46.71,24.41 IC1.64 | IC1.76 54.51,24.1 v54.74,23.88 | IC1.92 60.43,35.2 v61.09,34.54 60.57,33.9 IC1.90 | IC1.5 54.51,44.1 v54.99,44.58 | IC1.17 46.71,44.17 v47.12,44.58 47.82,44.58 48.3,44.57 48.66,44.2 IC1.14 | IC1.26 40.86,44.35 v40.64,44.58 | IC1.10 51.26,44.24 v50.93,44.58 | IC2.114 84.84,21.58 v84.84,20.83 | IC2.62 68.55,41.4 v67.69,41.4 | IC2.36 81.03,49.4 v81.03,50.67 | IC2.39 78.74,47.47 v78.74,47.24 | IC2.29 82.68,45.84 v82.68,45.72 | IC2.18 86.4,41.78 v86.36,41.78 | IC2.99 76.43,26.16 v76.58,26.16 | IC2.123 87.25,25.53 v87.38,25.53 | IC2.144 93.84,33.78 v94.87,33.78 | C8.1 74.42,75.53 75.88,76.99 D2.2 75.88,78.11
  Top 0.305: IC2.89 72.66,29.46 v73.15,29.46 73.15,29.25 IC2.90 | IC2.47 75.95,44.61 v75.95,44.45 | IC1.83 60.59,29.35 v60.96,29.72 | IC1.39 38.71,35.2 v39.12,34.8 | IC2.72 63.71,36.91 v63.5,36.83
  Top 0.406: 36.83,79.39 IC3.1 36.83,79.34 | C104.1
  Top 0.61: v72.77,74.3 C8.1 | C7.1 48.26,67.37 K6.2 | C5.1 v98.68,36.7 | IC4.2 70.87,56.13 IC6.7
  Top 0.813: C4.1 v97.03,9.14 96.9,9.14 | C3.1 v112.01,32 | C2.1 v113.92,36.58 | C1.1 v111.76,67.56 | C6.1 v96.52,87.88
  Top 1.016: 36.83,79.39 v36.83,80.77 C104.1 | v36.83,77.98 36.83,79.34 | C102.1 39.75,71.63 v41.15,71.63
  Bottom 0.254: 47.88,30.35 47.88,33.02 | 47.88,35.56 47.88,38.1
  other vias: 8.55,85.01 8.55,7 118.52,7 118.52,85.01
  pour Bottom (isolate 0.8, rank 2): 0,91.95 127,91.95 127,0 0,0 0,92.08
N$1
  Top 0.254: D2.1 R103.1
N$2
  Top 0.254: K7.9 12.5,33.22 15.49,30.23 R117.1
N$3
  Top 0.254: K7.8 12.29,35.97 15.49,32.77 R116.1
N$4
  Top 0.254: K7.7 12.06,38.73 15.49,35.31 R115.1
N$5
  Top 0.254: K7.6 11.84,41.5 15.49,37.85 R114.1
N$6
  Top 0.254: K7.5 11.63,44.25 15.49,40.39 R113.1
N$7
  Top 0.254: K7.4 13.95,47.02 15.49,45.47 R112.1
N$8
  Top 1.016: CON4.1 15.75,76.71 B1.AC1
N$9
  Top 0.254: K7.3 13.72,49.78 15.49,48.01 R111.1
N$10
  Top 0.254: K7.2 13.51,52.53 15.49,50.55 R110.1
N$11
  Top 1.016: CON4.3 6.48,73.53 CON4.2 3.3,80.26 19.3,80.26 B1.AC2
N$12
  Top 0.254: R109.1 15.75,55.37 15.75,55.3 K7.1
N$13
  Top 0.254: R131.2 K1.1
N$14
  Top 0.254: R132.2 K1.3
N$15
  Top 0.254: K1.5 119.13,74.93 118.87,75.18 R133.2
N$16
  Top 0.254: 119.38,72.64 K1.7 R134.2
N$17
  Top 0.254: D3.1 79.22,81.28 | D3.1 | D3.1 R104.1
N$18
  Top 0.254: R135.2 K1.9
N$19  (via drill 0.81)
  other vias: 69.6,62.48
N$20
  Top 0.406: 59.44,35.87 61.47,35.87 60.86,36.47 | 60.86,36.47 59.23,36.47 | 60.86,37.13 59.28,37.13 | 60.86,37.13 60.86,36.47 | 60.2,37.8 59.33,37.8 | 60.2,37.8 60.86,37.13 | 59.13,38.46 59.54,38.46 60.2,37.8
N$21
  Top 0.254: D4.1 | D4.1 R105.1
N$22
  Top 0.254: K7.11 R118.1
N$23
  Top 0.254: K7.14 14.66,53.92 15.49,53.09 R108.1
N$24
  Top 0.254: R136.2 K2.1
N$25
  Top 0.254: R137.2 K2.3
N$26
  Top 0.254: R138.2 K2.5
N$27
  Top 0.254: R139.2 K2.7
N$28
  Top 0.254: R140.2 K2.9
N$29
  Top 0.254: R141.2 K2.11
N$30
  Top 0.254: R142.2 K2.13
N$31
  Top 0.254: R143.2 K2.15
N$32
  Top 0.254: R144.2 K3.1
N$33
  Top 0.254: R145.2 K3.3
N$34
  Top 0.254: R146.2 K3.5
N$35
  Top 0.254: R147.2 K3.7
N$36
  Top 0.254: R148.2 K3.9
N$37
  Top 0.254: R149.2 K3.11
N$38
  Top 0.254: R150.2 K3.13
N$39
  Top 0.254: R151.2 K3.15
N$40
  Top 1.016: C102.2 36.83,74.67 36.86,74.7 IC3.2 28.57,74.81 C101.P 25.91,77.47 B1.+
N$41
  Top 0.254: R152.2 K4.1
N$42
  Top 0.254: R153.2 K4.3
N$43
  Top 0.254: R154.2 K4.5
N$44
  Top 0.254: R155.2 K4.7
N$45
  Top 0.254: D5.1 R106.1
N$46
  Top 0.254: R156.2 K4.9
N$47
  Top 0.254: R157.2 K4.11
N$48
  Top 0.254: R158.2 K4.13
N$49
  Top 0.254: R159.2 K4.15
N$50
  Top 0.254: R160.2 K5.1
N$53
  Top 0.254: R161.2 K5.3
N$54
  Top 0.254: R162.2 K5.5
N$55
  Top 0.254: R163.2 K5.7
N$56
  Top 0.254: R164.2 K5.9
N$57
  Top 0.254: R165.2 K5.11
N$58
  Top 0.254: R166.2 K5.13
N$59
  Top 0.254: R167.2 K5.15
N$60
  Top 0.254: K7.17 12.78,45.64 15.49,42.93 R107.1
OE
  Top 0.254: IC2.76 66.01,32 60.71,32 59.94,31.24 58.8,31.24 58.8,31.29 IC1.86
ST1
  Top 0.254: IC2.33 83.44,49.43 83.44,76.45 85.72,76.45 D5.2
ST2
  Top 0.254: IC2.34 82.93,49.63 82.93,76.83 82.55,77.22 D4.2 | D4.2 82.55,78.11 | D4.2
ST3
  Top 0.254: IC2.35 82.42,49.83 82.42,76.45 79.22,76.45 D3.2 | D3.2
TCK  (via drill 0.81 pad 1.42)  (1 unrouted)
  Top 0.254: IC2.67 68.45,37.83 v68.45,36.7
  Top 0.406: v55.88,57.15 K6.5
TDI  (via drill 0.81 pad 1.42)  (1 unrouted)
  Top 0.254: IC2.63 69.15,40.07 69.98,39.24 v71.25,39.24
  Top 0.406: v53.34,57.15 K6.4
TDO  (via drill 0.81 pad 1.42)  (1 unrouted)
  Top 0.254: IC2.122 84.71,27.36 v84.71,27.94
  Top 0.406: v50.8,57.15 K6.3
TMS  (via drill 0.81 pad 1.42)  (1 unrouted)
  Top 0.254: IC2.65 v69.85,37.97
  Top 0.406: v58.42,57.15 K6.6
TRIG_O
  Top 0.254: R135.1 K8.16 107.7,68.83 98.11,68.83 89.98,60.71 89.98,46.78 IC2.20
VCC0  (via drill 0.61, 0.81)
  Top 0.254: v24.38,55.63 R121.2 | v24.38,35.31 R127.2 | v24.38,37.85 R126.2 | v24.38,32.77 R128.2 | 22.79,40.13 R125.2 v24.38,40.39 | v24.38,30.23 R129.2 | v24.38,45.47 R124.2 | v24.38,42.93 R119.2 | v24.38,50.55 R122.2 | v24.38,48.01 R123.2 | v24.38,53.09 R120.2 | R130.2 v24.38,27.69 | 79.76,23.11 80.26,22.61 | 106.49,87.88 K8.1 | IC2.1 92.2,35.56 | v40.13,28.19 40.21,28.19 | IC2.73 v67.31,35.42 v67.31,35.43 68.07,34.67 70.99,34.67 | IC2.37 79.37,48.26 79.76,48.26 | IC2.42 77.98,46.11 77.98,45.72
  Top 0.305: 55.16,40.51 IC1.4 | IC1.11 50.61,40.77 50.67,40.51 | 48.01,40.51 IC1.15 | IC1.20 44.76,40.77 44.83,40.51 | 40.21,40.77 40.26,40.51 40.21,40.51 IC1.27 | 38.61,40.51 38.61,40.4 IC1.31 34.78,40.4 34.54,40.64 | IC2.109 79.76,23.11 | IC2.55 73.91,40.98 73.91,40.64 | IC2.84 71.67,32 72.14,32 | IC2.127 85.38,30.23 85.34,30.23 | IC2.141 90.45,35.05 90.42,35.05 | IC2.8 89.02,37.34 88.9,37.34 | IC2.42 78.62,45.47 78.74,45.47 | 56.64,38.45 IC1.97 | IC1.96 56.64,37.8 56.64,37.85 | IC1.95 56.64,37.15 56.64,37.08 | IC1.94 56.64,36.5 56.64,36.58 | 56.64,35.85 IC1.93 | 56.64,34.55 IC1.91 | IC1.87 56.64,31.95 v56.64,31.24 | IC1.84 56.64,30 56.64,29.97 | 55.16,28.15 IC1.77 | 55.16,28.15 55.12,28.19 55.16,28.19 55.16,28.15 | 50.61,28.19 IC1.70 | IC1.65 47.36,28.19 47.5,28.19 | 44.76,28.19 IC1.61 | 40.21,28.19 IC1.54 | IC1.41 v33.91,33.91
  Top 0.61: 38.1,69.85 38.1,70.36 | 123.44,32 123.44,11.68 K3.16 | 123.44,32 123.44,40.89 | 123.44,40.89 123.44,70.1 | 123.44,70.1 123.44,87.88 K8.2 106.49,87.88 K8.1 | 123.44,40.89 K2.16 119.13,38.35 C2.2 | 123.44,70.1 K1.10 119.13,67.56 C1.2 | R103.2 R104.2 | R104.2 79.18,85.85 | R104.2 R105.2 | R105.2 82.49,85.85 | R105.2 R106.2 85.79,85.85 | 123.44,32 C3.2 | C5.2 v108.97,38.35 | IC4.1 IC4.4 77.22,59.94 | C8.2 | 79.76,48.26 79.76,49.78
  Top 0.813: 48.01,40.51 v48.9,40.51 50.67,40.51 55.16,40.51 56.64,40.51 56.64,38.45 56.64,37.85 56.64,37.08 56.64,36.58 56.64,35.85 56.64,34.55 v56.64,31.24 56.64,29.97 56.64,28.19 55.12,28.19 50.61,28.19 47.5,28.19 44.76,28.19 40.21,28.19 | 48.01,40.51 44.83,40.51 40.26,40.51 | 38.61,40.51 40.21,40.51 | 79.76,23.11 v79.76,24 79.76,25.15 | 90.42,35.05 90.93,35.56 | 91.57,35.56 v91.31,35.56 95.5,35.56 | 60.8,36.86 62.21,35.46 67.33,35.46 v67.31,35.44 v67.31,35.43
  Top 1.016: v24.38,55.63 32.26,55.63
  Bottom 0.61: v24.38,27.69 v24.38,30.23 v24.38,32.77 v24.38,35.31 v24.38,37.85 v24.38,40.39 v24.38,42.93 v24.38,45.47 v24.38,48.01 v24.38,50.55 v24.38,53.09 v24.38,55.63 | v108.97,38.35 K4.16 | v48.9,40.51 C107.2 | C106.2 v33.91,33.91 | C113.2 v91.31,35.56 | C110.2 79.63,45.97 v80.14,46.48 | v79.76,24 C112.2
  Bottom 0.813: v36.58,25.15 v36.58,26.42 38.35,28.19 v40.13,28.19 v41.4,28.19 43.18,28.19 | 43.18,28.19 C108.2 | 43.18,28.19 43.18,28.45 | v56.64,31.24 C109.2 | C111.2 v67.31,35.43 67.44,35.43 | 33.54,37.89 33.52,37.87 C9.+ | 33.54,37.89 v33.54,39.81 | v33.92,33.92 33.54,34.3 33.54,37.89 | v82.94,37.38 82.94,35.55 C10.+ 82.94,35.33 v82.94,33.54
  Bottom 1.016: C105.2 v77.22,62.48
  pour Top (isolate 0.7): 79.76,46.74 90.93,35.56 79.76,24.38 68.58,35.56
  pour Top (isolate 0.5): 31.75,17.02 31.75,91.82 127,91.82 127,-0.25 64.77,-0.25 64.77,44.96 37.38,44.93 37.38,40.35 34.8,40.35 34.82,27.14 40.94,27.14 40.94,17.02
WE
  Top 0.254: IC1.88 58.83,32.64 65.94,32.64 IC2.75
X1
  Top 0.254: IC2.32 84.01,49.3 84.01,68.69 97.75,82.42 98.04,82.42 98.04,82.43 98.05,82.43 103.51,82.43 K8.3
X2
  Top 0.254: IC2.31 84.52,49.1 84.52,67.94 97.99,81.41 98.05,81.41 105.03,81.41 K8.5
X3
  Top 0.254: IC2.30 85.03,48.9 85.03,67.18 98.11,80.26 K8.7
X4
  Top 0.254: IC2.27 86.04,47.79 86.04,65.66 98.11,77.72 K8.9 106.49,77.72
X5
  Top 0.254: IC2.25 87.12,47.46 87.12,64.2 98.11,75.18 K8.11
X6
  Top 0.254: IC2.23 88.27,47.19 88.27,62.8 98.11,72.64 K8.13
X7
  Top 0.254: IC2.21 89.41,46.92 89.41,61.4 98.11,70.1 K8.15
X8
  Top 0.254: 114.55,72.64 R134.1 K8.14 107.7,71.37 98.04,71.37 88.84,62.17 88.84,47.05 IC2.22

### Text on the board
Top: TOP | miniLA v 1.1 LPT (c)2003-5 kosta@mcu.cz
Bottom: BOTTOM
tPlace: TDI | TDO | TCK | TMS | TDI | TMS | R107...R118 | TCK | TDO
tStop: SMTOP | miniLA v 1.1 LPT (c)2003-5 kosta@mcu.cz
bStop: SMBOT